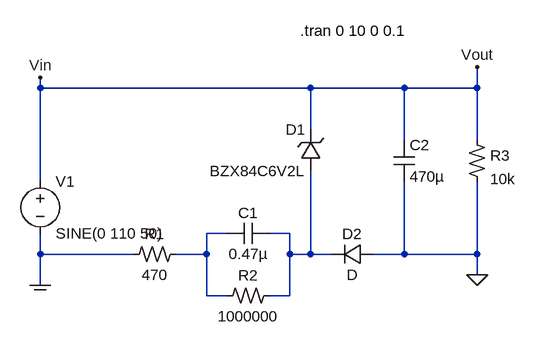
[diagram p0: schematic Capacitive Transformerless.asc]
Capacitive Transformerless.asc, the LTspice schematic file:
Version 4
SHEET 1 900 680
WIRE 128 160 128 144
WIRE 544 160 128 160
WIRE 688 160 544 160
WIRE 800 160 800 128
WIRE 800 160 688 160
WIRE 544 224 544 160
WIRE 688 240 688 160
WIRE 800 240 800 160
WIRE 128 304 128 160
WIRE 416 384 384 384
WIRE 512 384 480 384
WIRE 128 416 128 384
WIRE 272 416 128 416
WIRE 384 416 384 384
WIRE 384 416 336 416
WIRE 512 416 512 384
WIRE 544 416 544 288
WIRE 544 416 512 416
WIRE 576 416 544 416
WIRE 688 416 688 304
WIRE 688 416 640 416
WIRE 800 416 800 304
WIRE 800 416 688 416
WIRE 800 448 800 416
WIRE 128 464 128 416
WIRE 384 480 384 416
WIRE 416 480 384 480
WIRE 512 480 512 416
WIRE 512 480 480 480
FLAG 800 448 0
FLAG 128 464 COM
FLAG 800 128 Vout
FLAG 128 144 Vin
SYMBOL voltage 128 288 R0
SYMATTR InstName V1
SYMATTR Value SINE(0 110 50)
SYMBOL res2 336 400 R90
WINDOW 0 0 32 VBottom 2
WINDOW 3 32 32 VTop 2
SYMATTR InstName R1
SYMATTR Value 470
SYMBOL res2 480 464 R90
WINDOW 0 0 32 VBottom 2
WINDOW 3 32 32 VTop 2
SYMATTR InstName R2
SYMATTR Value 1000000
SYMBOL cap 480 368 R90
WINDOW 0 0 32 VBottom 2
WINDOW 3 32 32 VTop 2
SYMATTR InstName C1
SYMATTR Value 0.47µ
SYMBOL zener 560 288 R180
WINDOW 0 24 64 Left 2
WINDOW 3 24 0 Left 2
SYMATTR InstName D1
SYMATTR Value BZX84C6V2L
SYMBOL cap 672 240 R0
SYMATTR InstName C2
SYMATTR Value 470µ
SYMBOL diode 640 400 R90
WINDOW 0 0 32 VBottom 2
WINDOW 3 32 32 VTop 2
SYMATTR InstName D2
SYMBOL res2 784 240 R0
SYMATTR InstName R3
SYMATTR Value 10k
TEXT 528 72 Left 2 !.tran 0 10 0 0.1

The netlist it stands for:
* Capacitive Transformerless.asc
V1 Vin COM SINE(0 110 50)
R1 N001 COM 470
R2 N002 N001 1000000
C1 N002 N001 0.47µ
D1 N002 Vin BZX84C6V2L
C2 Vin 0 470µ
D2 0 N002 D
R3 Vin 0 10k
.model D D
.lib standard.dio
.tran 0 10 0 0.1
.backanno
.end